# EAGLE design pcb master v2 (EAGLE 9.5.1)
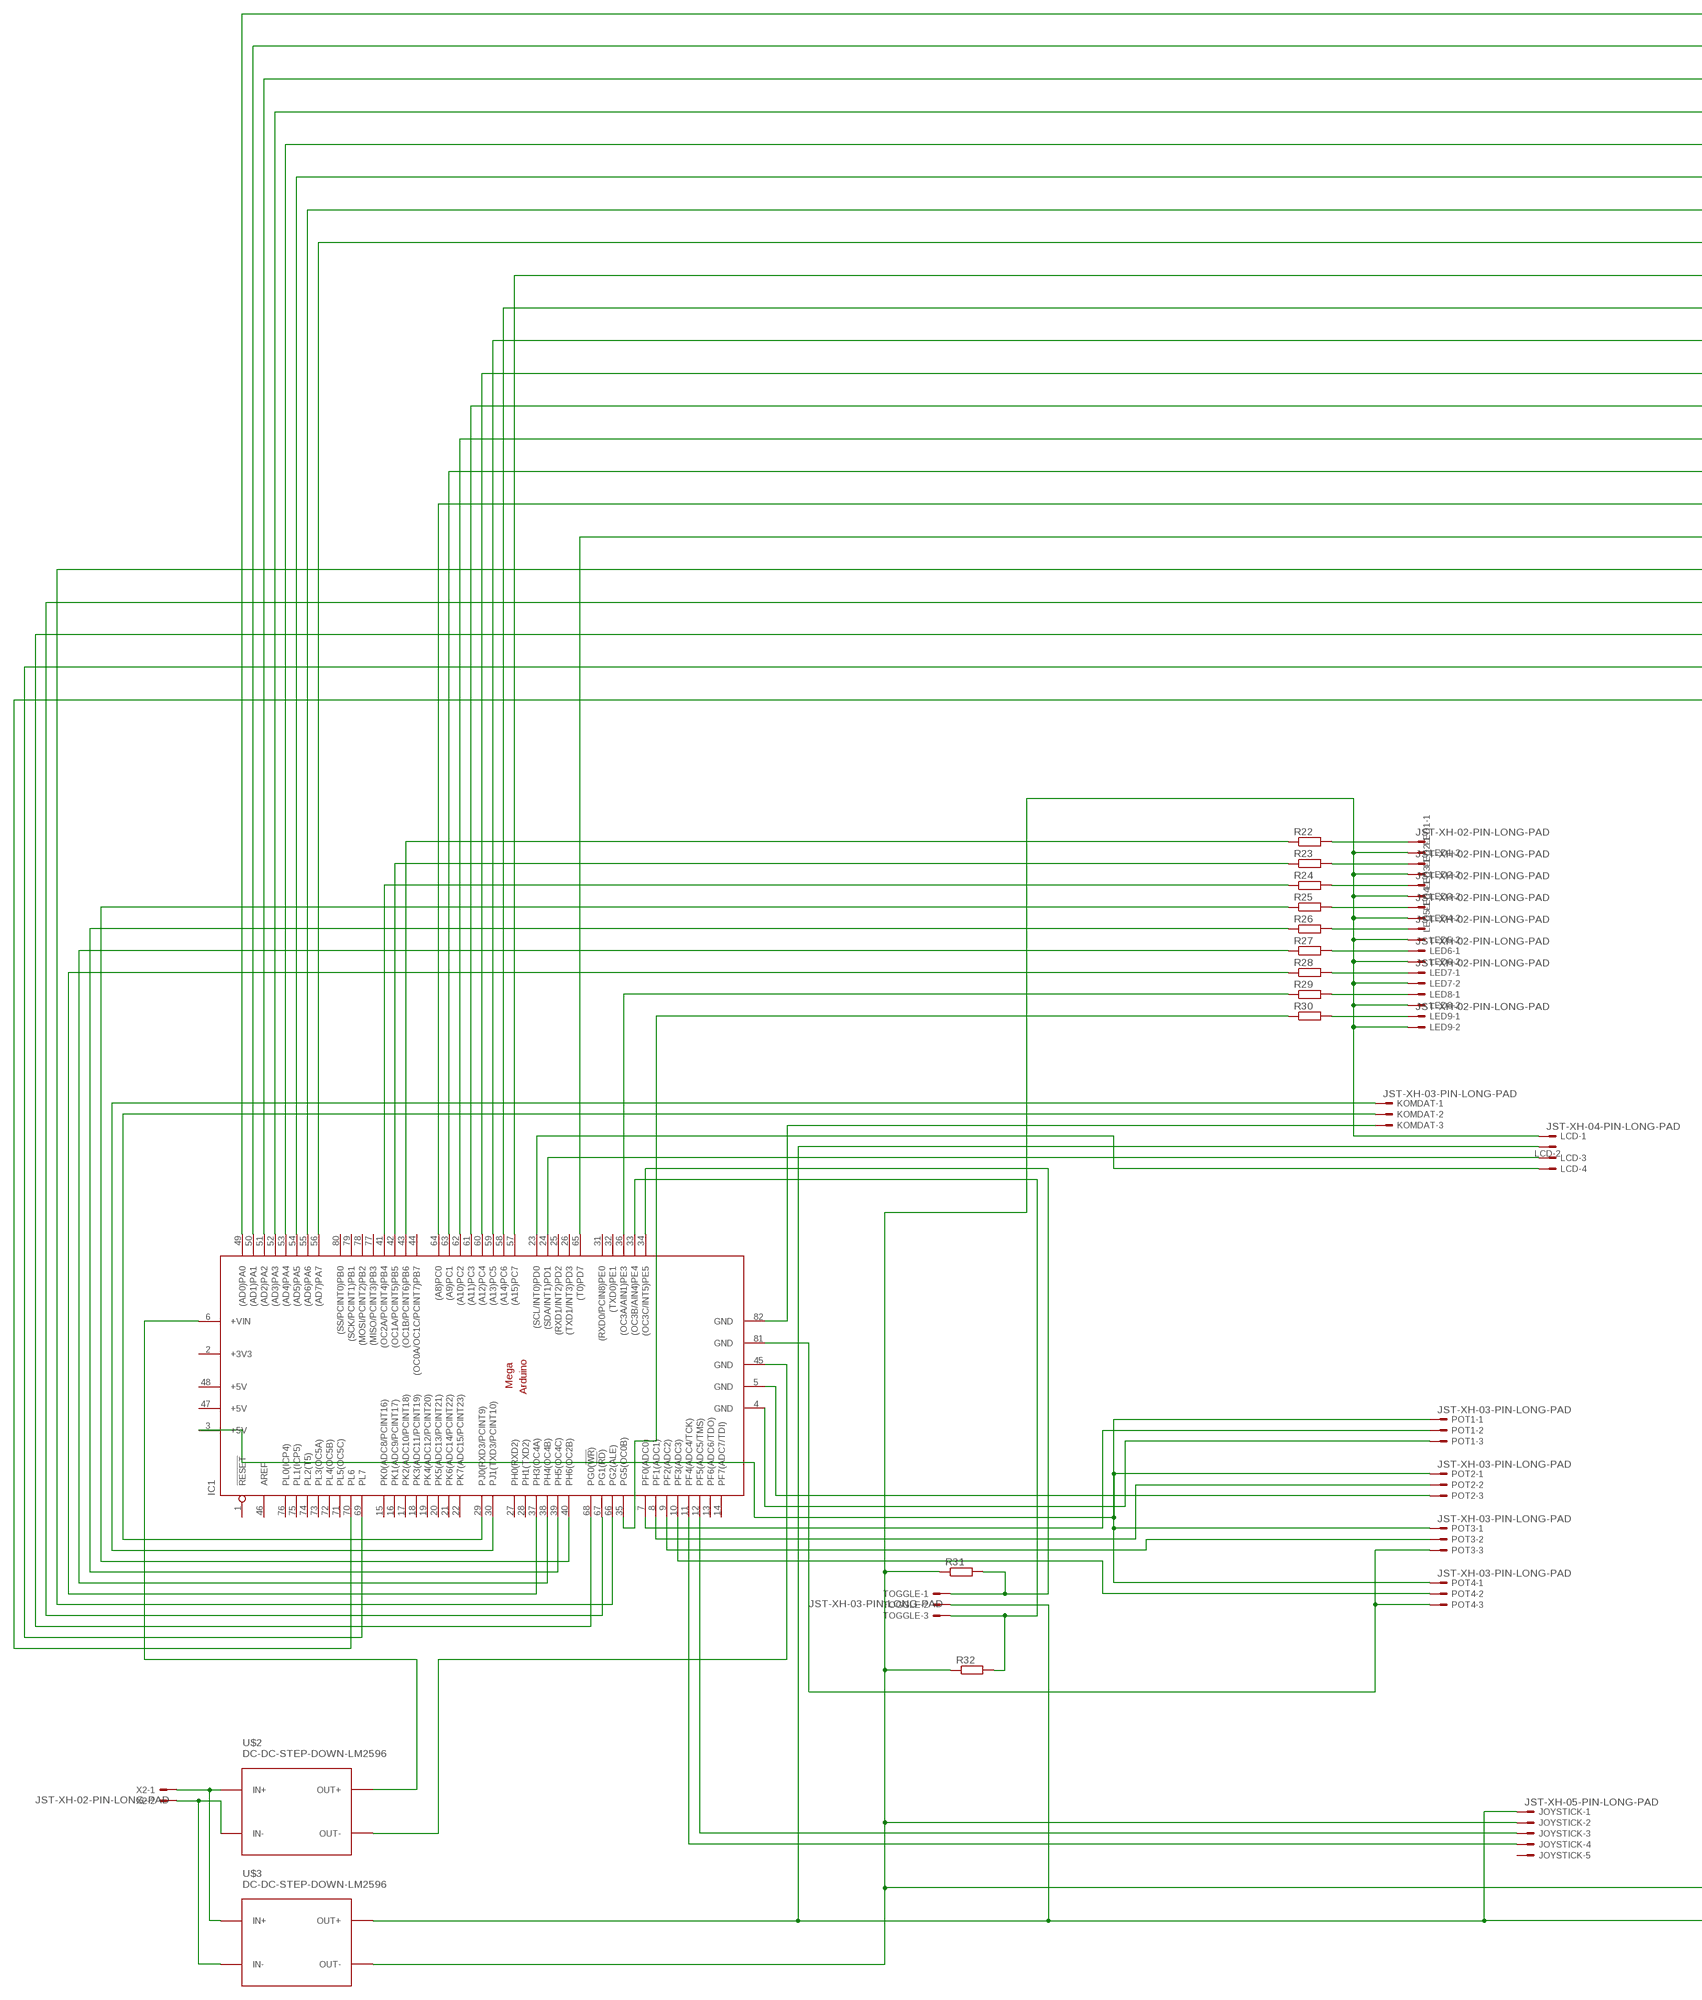
[diagram p0: schematic, sheet 1, part 1 of 2]
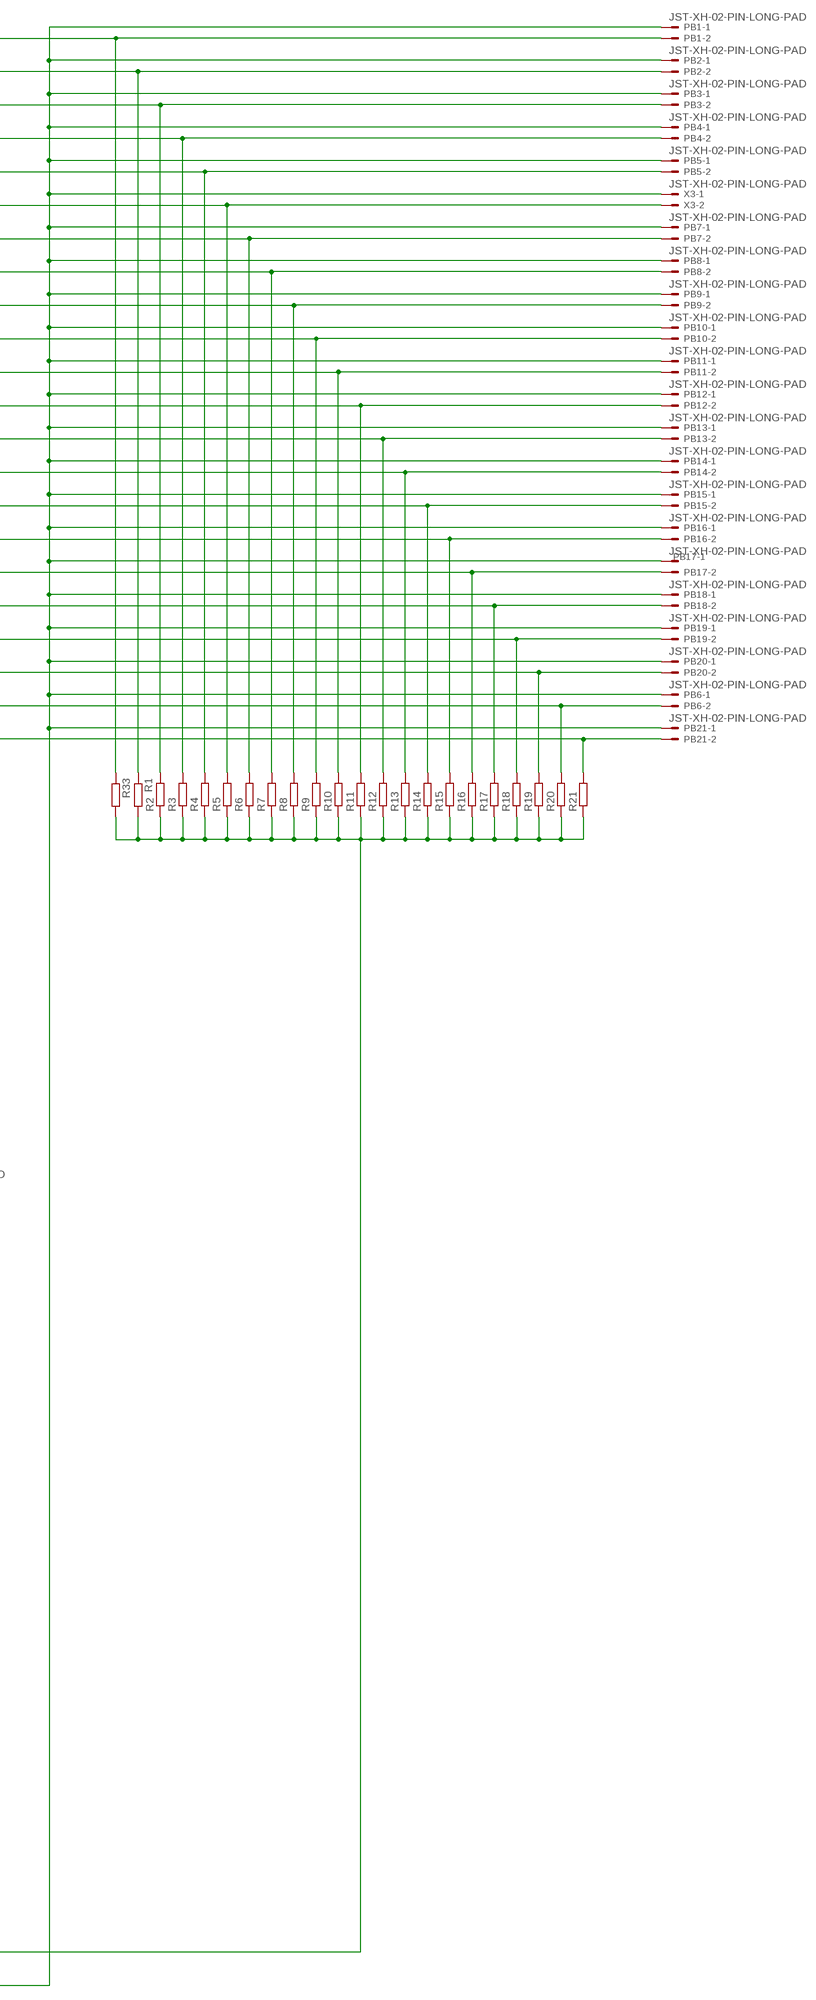
[diagram p1: schematic, sheet 1, part 2 of 2]

## Parts
IC1  MEGAARDUINO_1  [MEGA_ARDUINO]
JOYSTICK  JST-XH-05-PIN-LONG-PAD  [JST-XH-05-PACKAGE-LONG-PAD]
KOMDAT  JST-XH-03-PIN-LONG-PAD  [JST-XH-03-PACKAGE-LONG-PAD]
LCD  JST-XH-04-PIN-LONG-PAD  [JST-XH-04-PACKAGE-LONG-PAD]
LED1  JST-XH-02-PIN-LONG-PAD  [JST-XH-02-PACKAGE-LONG-PAD]
LED2  JST-XH-02-PIN-LONG-PAD  [JST-XH-02-PACKAGE-LONG-PAD]
LED3  JST-XH-02-PIN-LONG-PAD  [JST-XH-02-PACKAGE-LONG-PAD]
LED4  JST-XH-02-PIN-LONG-PAD  [JST-XH-02-PACKAGE-LONG-PAD]
LED5  JST-XH-02-PIN-LONG-PAD  [JST-XH-02-PACKAGE-LONG-PAD]
LED6  JST-XH-02-PIN-LONG-PAD  [JST-XH-02-PACKAGE-LONG-PAD]
LED7  JST-XH-02-PIN-LONG-PAD  [JST-XH-02-PACKAGE-LONG-PAD]
LED8  JST-XH-02-PIN-LONG-PAD  [JST-XH-02-PACKAGE-LONG-PAD]
LED9  JST-XH-02-PIN-LONG-PAD  [JST-XH-02-PACKAGE-LONG-PAD]
PB1  JST-XH-02-PIN-LONG-PAD  [JST-XH-02-PACKAGE-LONG-PAD]
PB2  JST-XH-02-PIN-LONG-PAD  [JST-XH-02-PACKAGE-LONG-PAD]
PB3  JST-XH-02-PIN-LONG-PAD  [JST-XH-02-PACKAGE-LONG-PAD]
PB4  JST-XH-02-PIN-LONG-PAD  [JST-XH-02-PACKAGE-LONG-PAD]
PB5  JST-XH-02-PIN-LONG-PAD  [JST-XH-02-PACKAGE-LONG-PAD]
PB6  JST-XH-02-PIN-LONG-PAD  [JST-XH-02-PACKAGE-LONG-PAD]
PB7  JST-XH-02-PIN-LONG-PAD  [JST-XH-02-PACKAGE-LONG-PAD]
PB8  JST-XH-02-PIN-LONG-PAD  [JST-XH-02-PACKAGE-LONG-PAD]
PB9  JST-XH-02-PIN-LONG-PAD  [JST-XH-02-PACKAGE-LONG-PAD]
PB10  JST-XH-02-PIN-LONG-PAD  [JST-XH-02-PACKAGE-LONG-PAD]
PB11  JST-XH-02-PIN-LONG-PAD  [JST-XH-02-PACKAGE-LONG-PAD]
PB12  JST-XH-02-PIN-LONG-PAD  [JST-XH-02-PACKAGE-LONG-PAD]
PB13  JST-XH-02-PIN-LONG-PAD  [JST-XH-02-PACKAGE-LONG-PAD]
PB14  JST-XH-02-PIN-LONG-PAD  [JST-XH-02-PACKAGE-LONG-PAD]
PB15  JST-XH-02-PIN-LONG-PAD  [JST-XH-02-PACKAGE-LONG-PAD]
PB16  JST-XH-02-PIN-LONG-PAD  [JST-XH-02-PACKAGE-LONG-PAD]
PB17  JST-XH-02-PIN-LONG-PAD  [JST-XH-02-PACKAGE-LONG-PAD]
PB18  JST-XH-02-PIN-LONG-PAD  [JST-XH-02-PACKAGE-LONG-PAD]
PB19  JST-XH-02-PIN-LONG-PAD  [JST-XH-02-PACKAGE-LONG-PAD]
PB20  JST-XH-02-PIN-LONG-PAD  [JST-XH-02-PACKAGE-LONG-PAD]
PB21  JST-XH-02-PIN-LONG-PAD  [JST-XH-02-PACKAGE-LONG-PAD]
POT1  JST-XH-03-PIN-LONG-PAD  [JST-XH-03-PACKAGE-LONG-PAD]
POT2  JST-XH-03-PIN-LONG-PAD  [JST-XH-03-PACKAGE-LONG-PAD]
POT3  JST-XH-03-PIN-LONG-PAD  [JST-XH-03-PACKAGE-LONG-PAD]
POT4  JST-XH-03-PIN-LONG-PAD  [JST-XH-03-PACKAGE-LONG-PAD]
R1  R-EU_0207/12  [0207/12]
R2  R-EU_0207/12  [0207/12]
R3  R-EU_0207/12  [0207/12]
R4  R-EU_0207/12  [0207/12]
R5  R-EU_0207/12  [0207/12]
R6  R-EU_0207/12  [0207/12]
R7  R-EU_0207/12  [0207/12]
R8  R-EU_0207/12  [0207/12]
R9  R-EU_0207/12  [0207/12]
R10  R-EU_0207/12  [0207/12]
R11  R-EU_0207/12  [0207/12]
R12  R-EU_0207/12  [0207/12]
R13  R-EU_0207/12  [0207/12]
R14  R-EU_0207/12  [0207/12]
R15  R-EU_0207/12  [0207/12]
R16  R-EU_0207/12  [0207/12]
R17  R-EU_0207/12  [0207/12]
R18  R-EU_0207/12  [0207/12]
R19  R-EU_0207/12  [0207/12]
R20  R-EU_0207/12  [0207/12]
R21  R-EU_0207/12  [0207/12]
R22  R-EU_0207/12  [0207/12]
R23  R-EU_0207/12  [0207/12]
R24  R-EU_0207/12  [0207/12]
R25  R-EU_0207/12  [0207/12]
R26  R-EU_0207/12  [0207/12]
R27  R-EU_0207/12  [0207/12]
R28  R-EU_0207/12  [0207/12]
R29  R-EU_0207/12  [0207/12]
R30  R-EU_0207/12  [0207/12]
R31  R-EU_0207/12  [0207/12]
R32  R-EU_0207/12  [0207/12]
R33  R-EU_0207/12  [0207/12]
TOGGLE  JST-XH-03-PIN-LONG-PAD  [JST-XH-03-PACKAGE-LONG-PAD]
U$2  DC-DC-STEP-DOWN-LM2596  [DC-DC-STEP-DOWN-LM2596]
U$3  DC-DC-STEP-DOWN-LM2596  [DC-DC-STEP-DOWN-LM2596]
X2  JST-XH-02-PIN-LONG-PAD  [JST-XH-02-PACKAGE-LONG-PAD]
X3  JST-XH-02-PIN-LONG-PAD  [JST-XH-02-PACKAGE-LONG-PAD]

## Nets
N$1: IC1.33((OC3B/AIN4)PE4) R32.2 TOGGLE.3
N$3: U$2.IN+ U$3.IN+ X2.1
N$4: U$2.IN- U$3.IN- X2.2
N$5: IC1.60((A12)PC4) PB12.2 R11.2
N$7: IC1.7(PF0(ADC0)) POT1.2
N$8: LED1.1 R22.2
N$9: LED2.1 R23.2
N$10: IC1.10(PF3(ADC3)) POT4.2
N$11: IC1.34((OC3C/INT5)PE5) R31.2 TOGGLE.1
N$12: LED3.1 R24.2
N$13: IC1.57((A15)PC7) PB9.2 R8.2
N$14: IC1.8(PF1(ADC1)) POT2.2
N$15: IC1.9(PF2(ADC2)) POT3.2
N$16: IC1.82(GND) KOMDAT.3
N$18: IC1.11(PF4(ADC4/TCK)) JOYSTICK.4
N$19: IC1.81(GND) POT3.3 POT4.3
N$21: LED4.1 R25.2
N$22: IC1.24((SDA/INT1)PD1) LCD.3
N$23: IC1.23((SCL/INT0)PD0) LCD.4
N$24: IC1.29(PJ0(RXD3/PCINT9)) KOMDAT.2
N$26: IC1.70(PL6) PB21.2 R21.2
N$27: IC1.59((A13)PC5) PB11.2 R10.2
N$28: IC1.69(PL7) PB6.2 R20.2
N$29: IC1.45(GND) U$2.OUT-
N$30: JOYSTICK.2 LCD.1 LED1.2 LED2.2 LED3.2 LED4.2 LED5.2 LED6.2 LED7.2 LED8.2 LED9.2 R1.2 R2.1 R3.1 R4.1 R5.1 R6.1 R7.1 R8.1 R9.1 R10.1 R11.1 R12.1 R13.1 R14.1 R15.1 R16.1 R17.1 R18.1 R19.1 R20.1 R21.1 R31.1 R32.1 R33.2 U$3.OUT-
N$31: LED7.1 R28.2
N$32: IC1.6(+VIN) U$2.OUT+
N$33: IC1.65((T0)PD7) PB17.2 R16.2
N$34: IC1.3(+5V) POT1.1 POT2.1 POT3.1 POT4.1
N$36: IC1.64((A8)PC0) PB16.2 R15.2
N$37: IC1.30(PJ1(TXD3/PCINT10)) KOMDAT.1
N$39: IC1.66(PG2(ALE)) PB18.2 R17.2
N$40: IC1.12(PF5(ADC5/TMS)) JOYSTICK.3
N$42: IC1.54((AD5)PA5) R5.2 X3.2
N$43: IC1.58((A14)PC6) PB10.2 R9.2
N$44: IC1.49((AD0)PA0) PB1.2 R33.1
N$45: IC1.68(PG0(!WR!)) PB20.2 R19.2
N$46: IC1.50((AD1)PA1) PB2.2 R1.1
N$47: IC1.52((AD3)PA3) PB4.2 R3.2
N$48: LED5.1 R26.2
N$49: LED6.1 R27.2
N$52: LED8.1 R29.2
N$53: LED9.1 R30.2
N$58: IC1.35(PG5(OC0B)) R30.1
N$59: IC1.36((OC3A/AIN1)PE3) R29.1
N$60: IC1.37(PH3(OC4A)) R28.1
N$61: IC1.38(PH4(OC4B)) R27.1
N$62: IC1.39(PH5(OC4C)) R26.1
N$63: IC1.40(PH6(OC2B)) R25.1
N$64: IC1.41((OC2A/PCINT4)PB4) R24.1
N$65: IC1.42((OC1A/PCINT5)PB5) R23.1
N$66: IC1.43((OC1B/PCINT6)PB6) R22.1
N$67: IC1.62((A10)PC2) PB14.2 R13.2
N$68: IC1.56((AD7)PA7) PB8.2 R7.2
N$70: IC1.4(GND) POT1.3
N$71: IC1.5(GND) POT2.3
N$75: IC1.61((A11)PC3) PB13.2 R12.2
N$76: IC1.63((A9)PC1) PB15.2 R14.2
N$81: IC1.67(PG1(!RD!)) PB19.2 R18.2
N$83: JOYSTICK.1 LCD.2 PB1.1 PB2.1 PB3.1 PB4.1 PB5.1 PB6.1 PB7.1 PB8.1 PB9.1 PB10.1 PB11.1 PB12.1 PB13.1 PB14.1 PB15.1 PB16.1 PB17.1 PB18.1 PB19.1 PB20.1 PB21.1 TOGGLE.2 U$3.OUT+ X3.1
N$91: IC1.51((AD2)PA2) PB3.2 R2.2
N$92: IC1.53((AD4)PA4) PB5.2 R4.2
N$93: IC1.55((AD6)PA6) PB7.2 R6.2
Unconnected: IC1.1(!RESET) IC1.13(PF6(ADC6/TDO)) IC1.14(PF7(ADC7/TDI)) IC1.15(PK0(ADC8/PCINT16)) IC1.16(PK1(ADC9/PCINT17)) IC1.17(PK2(ADC10/PCINT18)) IC1.18(PK3(ADC11/PCINT19)) IC1.19(PK4(ADC12/PCINT20)) IC1.20(PK5(ADC13/PCINT21)) IC1.21(PK6(ADC14/PCINT22)) IC1.22(PK7(ADC15/PCINT23)) IC1.25((RXD1/INT2)PD2) IC1.26((TXD1/INT3)PD3) IC1.27(PH0(RXD2)) IC1.28(PH1(TXD2)) IC1.31((RXD0/PCIN8)PE0) IC1.32((TXD0)PE1) IC1.44((OC0A/OC1C/PCINT7)PB7) IC1.46(AREF) IC1.71(PL5(OC5C)) IC1.72(PL4(OC5B)) IC1.73(PL3(OC5A)) IC1.74(PL2(T5)) IC1.75(PL1(ICP5)) IC1.76(PL0(ICP4)) IC1.77((MISO/PCINT3)PB3) IC1.78((MOSI/PCINT2)PB2) IC1.79((SCK/PCINT1)PB1) IC1.80((SS/PCINT0)PB0) JOYSTICK.5

## Power pins joined to a net without a drawn wire
+3V3: IC1.2(+3V3)
+5V: IC1.47(+5V) IC1.48(+5V)

## Library data of the parts
IC1 = arduino:MEGAARDUINO_1: The Arduino Mega is a microcontroller board based on the ATmega1280. - 54 digital input/output pins (of which 14 can be used as PWM outputs) - 16 analog inputs - 4 UARTs (hardware serial ports) - 16 MHz crystal oscillator - USB connection - power jack - ICSP header - reset button It contains everything needed to support the microcontroller; simply connect it to a computer with a USB cable or power it with a AC-to-DC adapter or battery to get started. The Mega is compatible with most shields designed for the Arduino Duemilanove or Diecimila. http://arduino.cc/en/Main/ArduinoBoardMega
JOYSTICK = Rembrandt Electronics - JST XH Connectors v1-0:JST-XH-05-PIN: JST XH Connector 2 Pin Wire to board connector. Pitch: 2,54 mm, (0.100") Number of pins: 5 Created by Rembrandt Electronics www.rembrandtelectronics.com
KOMDAT POT1-POT4 TOGGLE = Rembrandt Electronics - JST XH Connectors v1-0:JST-XH-03-PIN: JST XH Connector 2 Pin Wire to board connector. Pitch: 2,54 mm, (0.100") Number of pins: 3 Created by Rembrandt Electronics www.rembrandtelectronics.com
LCD = Rembrandt Electronics - JST XH Connectors v1-0:JST-XH-04-PIN: JST XH Connector 2 Pin Wire to board connector. Pitch: 2,54 mm, (0.100") Number of pins: 4 Created by Rembrandt Electronics www.rembrandtelectronics.com
LED1-LED9 PB1-PB21 X2 X3 = Rembrandt Electronics - JST XH Connectors v1-0:JST-XH-02-PIN: JST XH Connector 2 Pin Wire to board connector. Pitch: 2,54 mm, (0.100") Number of pins: 2 Created by Rembrandt Electronics www.rembrandtelectronics.com
R1-R33 = rcl:R-EU_: RESISTOR, European symbol; SPICEPREFIX: R
U$2 U$3 = diy-modules:DC-DC-STEP-DOWN-LM2596: DC/DC Step-Down Regulator based on LM2596-ADJ chip

## Board
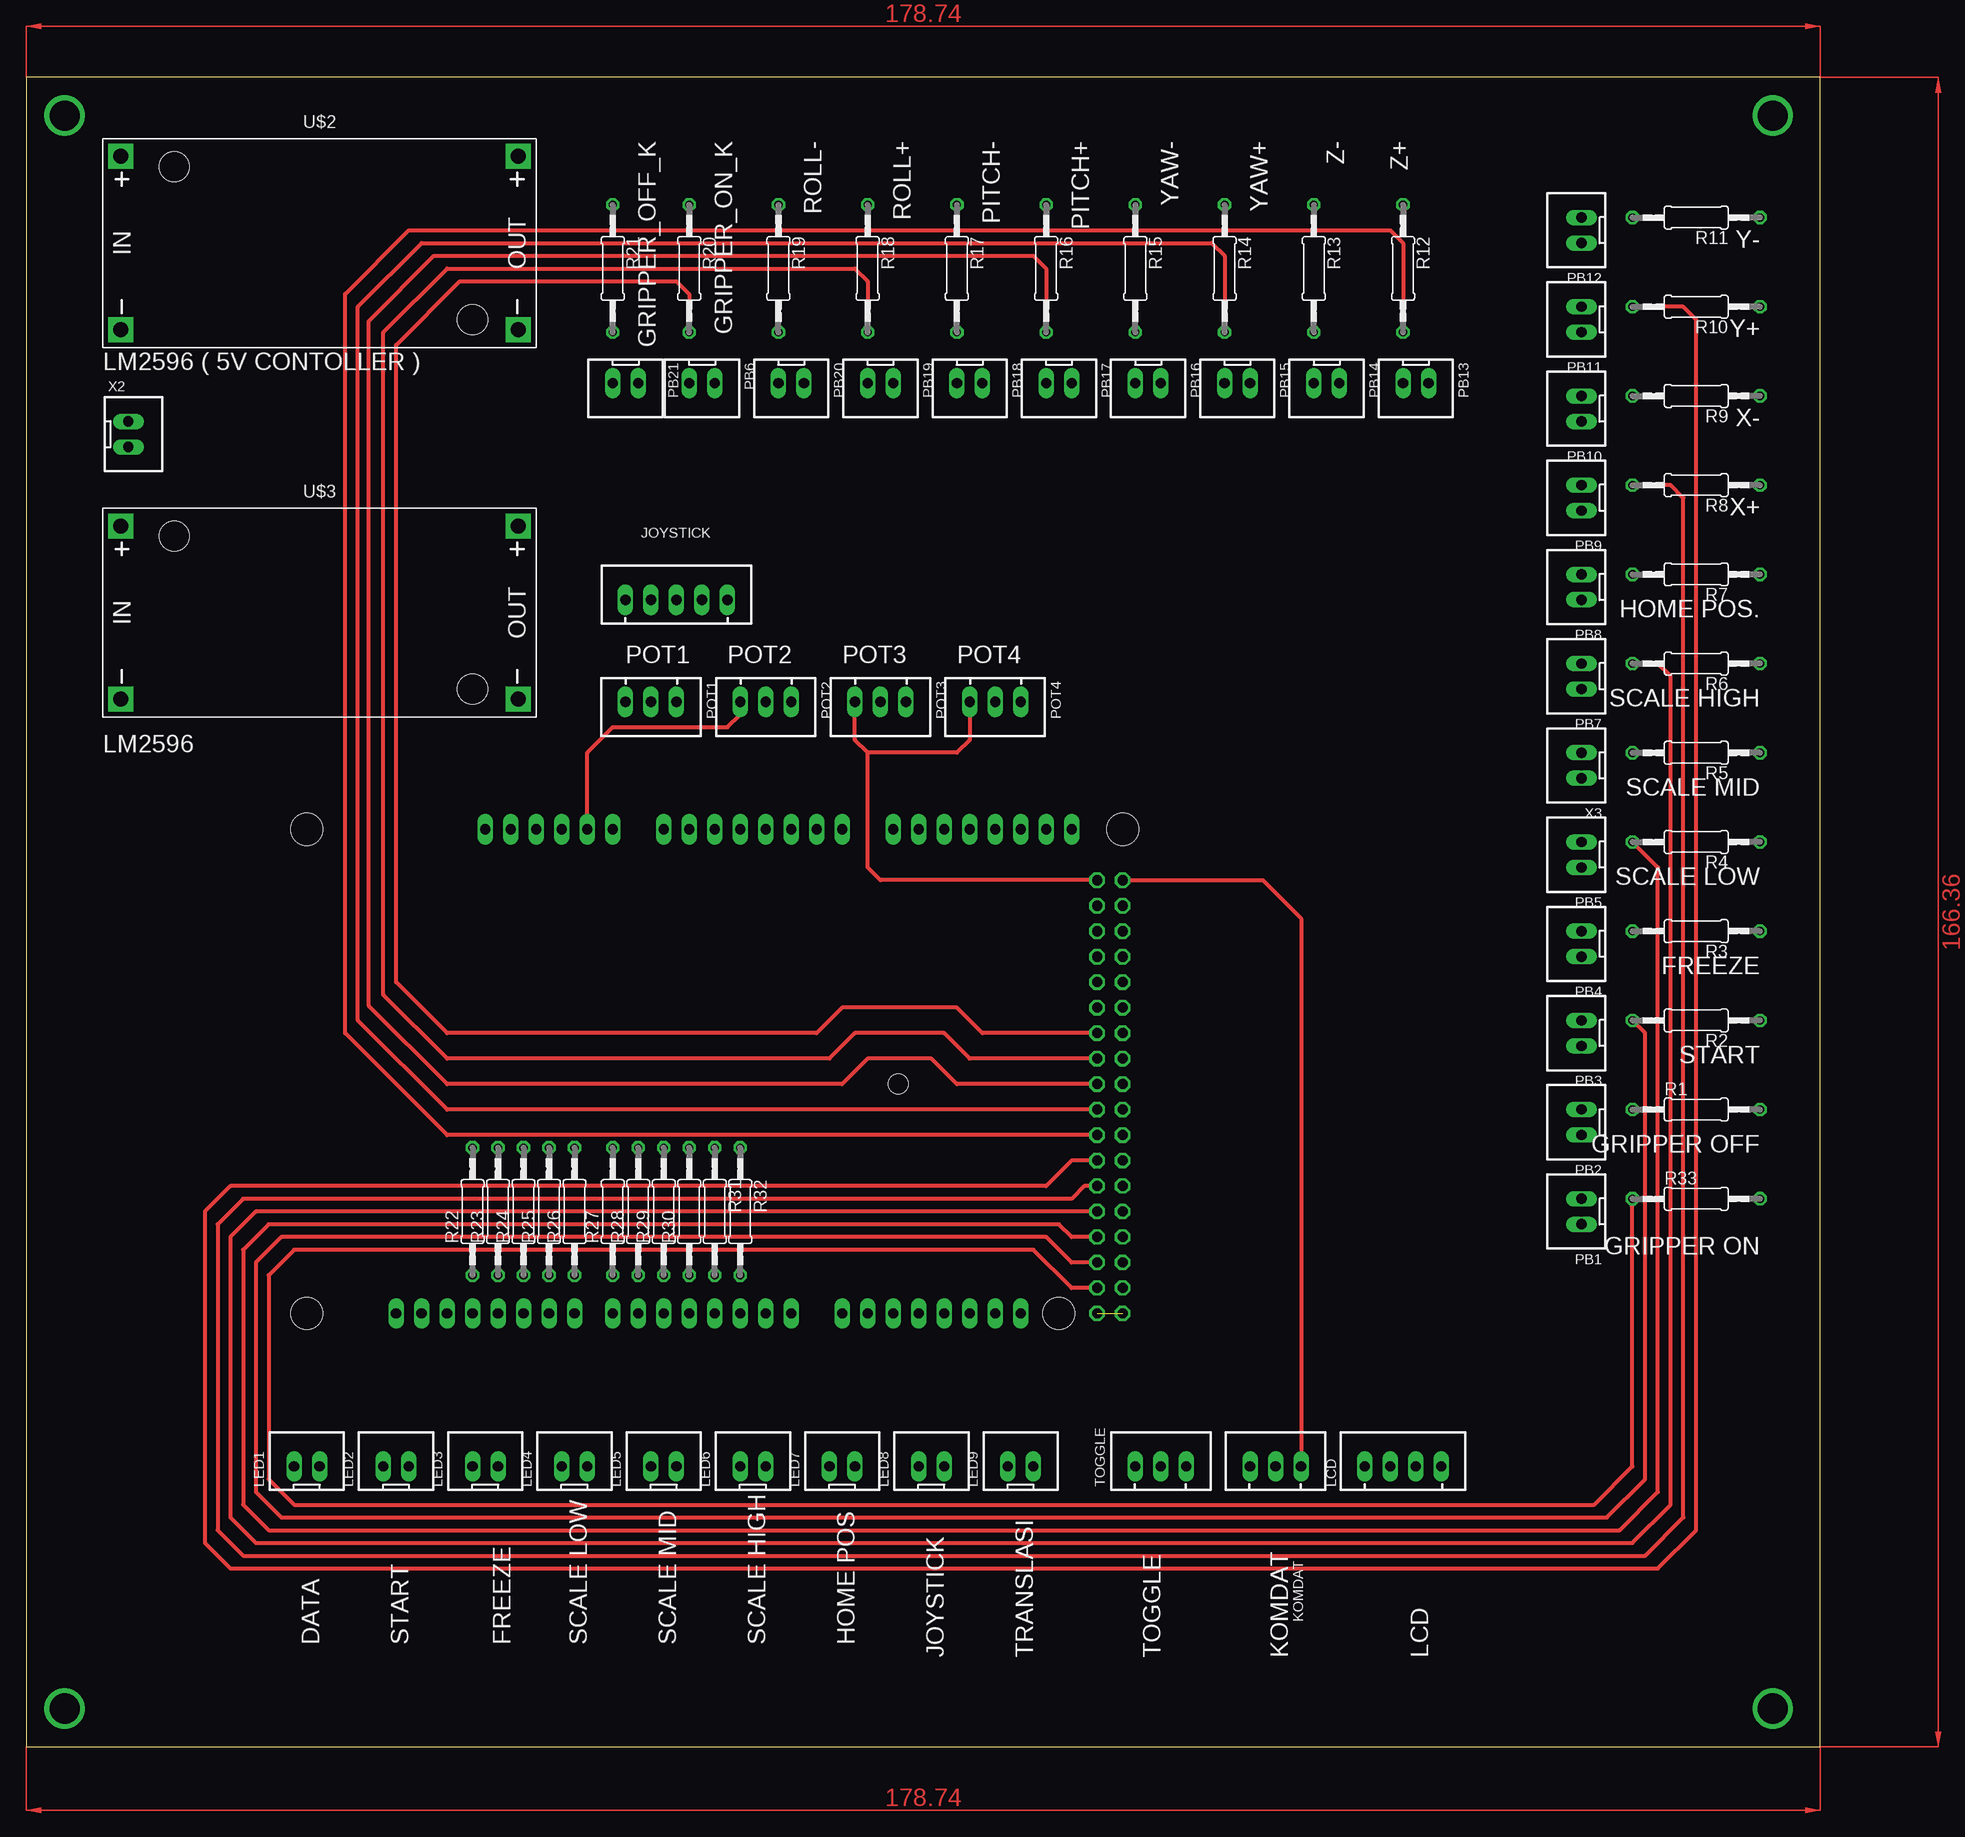
[diagram p2: board, top side]
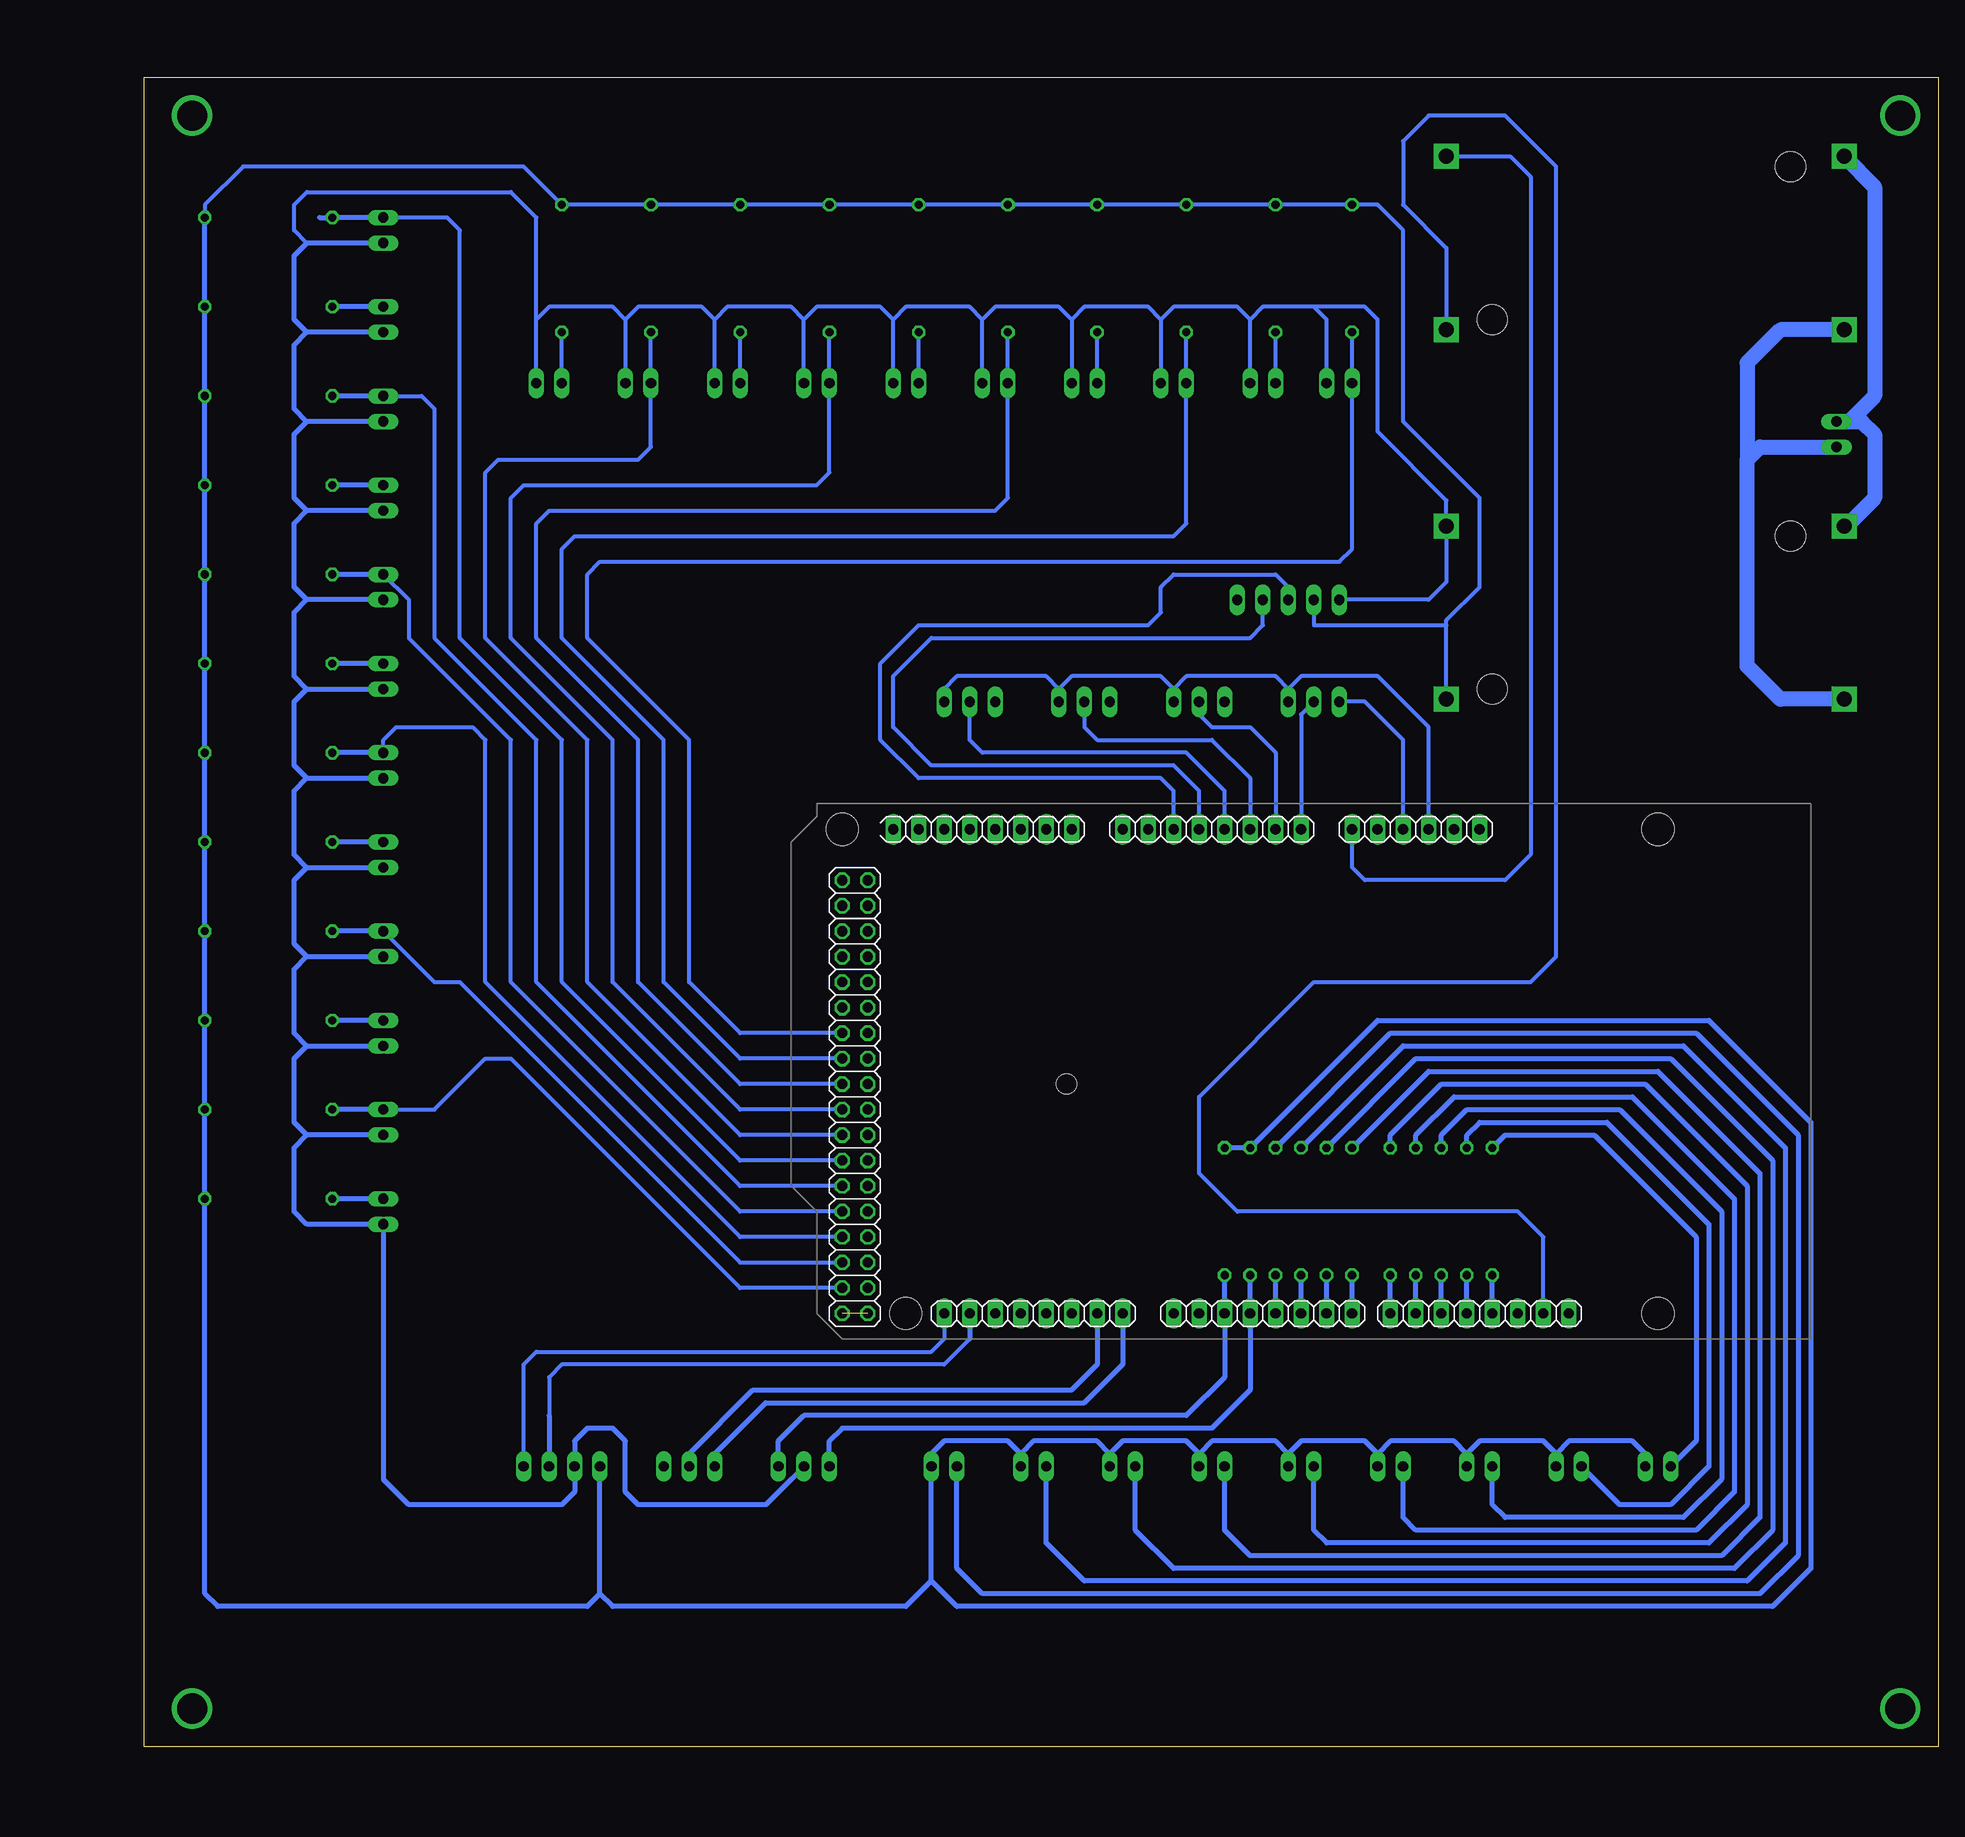
[diagram p3: board, bottom side, seen from below]

Size 178.74 x 166.36 mm. Coordinates in mm from the lower left corner, seen from the top.
Outline: 0,0 178.74,0 178.74,166.36 0,166.36 0,0
Copper layers (1*16): Top 0.035mm / dielectric 1.5mm / Bottom 0.035mm
Design rules "default *": minimum track width 6mil, minimum drill 0.35mm, track to track 10mil, track to pad 10mil, pad to pad 6mil, via to via 6mil, smd to smd 6mil, copper to edge 40mil, drill to drill 6mil, minimum pad ring 10mil, minimum via ring 8mil, stop-mask expansion 4mil, vias tented up to drill 0mil, thermal gap 10mil

### Footprints (pad centres in the part's own frame; a part is rotated, then mirrored left to right if it is on the bottom)
MEGA_ARDUINO = drill 1.016 long: 1 33.02,2.54; 2 35.56,2.54; 3 38.1,2.54; 4 40.64,2.54; 5 43.18,2.54; 6 45.72,2.54; 7 50.8,2.54; 8 53.34,2.54; 9 55.88,2.54; 10 58.42,2.54; 11 60.96,2.54; 12 63.5,2.54; 13 66.04,2.54; 14 68.58,2.54; 15 73.66,2.54; 16 76.2,2.54; 17 78.74,2.54; 18 81.28,2.54; 19 83.82,2.54; 20 86.36,2.54; 21 88.9,2.54; 22 91.44,2.54; 23 86.36,50.8; 24 83.82,50.8; 25 81.28,50.8; 26 78.74,50.8; 27 76.2,50.8; 28 73.66,50.8; 29 71.12,50.8; 30 68.58,50.8; 31 63.5,50.8; 32 60.96,50.8; 33 58.42,50.8; 34 55.88,50.8; 35 53.34,50.8; 36 50.8,50.8; 37 48.26,50.8; 38 45.72,50.8; 39 41.91,50.8; 40 39.37,50.8; 41 36.83,50.8; 42 34.29,50.8; 43 31.75,50.8; 44 29.21,50.8; 45 26.67,50.8; 46 24.13,50.8 | drill 1.016 octagon: 47 93.98,50.8; 48 96.52,50.8; 49 93.98,48.26; 50 96.52,48.26; 51 93.98,45.72; 52 96.52,45.72; 53 93.98,43.18; 54 96.52,43.18; 55 93.98,40.64; 56 96.52,40.64; 57 93.98,38.1; 58 96.52,38.1; 59 93.98,35.56; 60 96.52,35.56; 61 93.98,33.02; 62 96.52,33.02; 63 93.98,30.48; 64 96.52,30.48; 65 93.98,27.94; 66 96.52,27.94; 67 93.98,25.4; 68 96.52,25.4; 69 93.98,22.86; 70 96.52,22.86; 71 93.98,20.32; 72 96.52,20.32; 73 93.98,17.78; 74 96.52,17.78; 75 93.98,15.24; 76 96.52,15.24; 77 93.98,12.7; 78 96.52,12.7; 79 93.98,10.16; 80 96.52,10.16; 81 93.98,7.62; 82 96.52,7.62 | hole 3.2: 15.24,50.8; 15.24,2.54; 90.17,50.8; 96.52,2.54 | hole 2: 74.168,27.94
JST-XH-05-PACKAGE-LONG-PAD = drill 1.016 long: 1 -5.08,0; 2 -2.54,0; 3 0,0; 4 2.54,0; 5 5.08,0
JST-XH-03-PACKAGE-LONG-PAD = drill 1.016 long: 1 -2.54,0; 2 0,0; 3 2.54,0
JST-XH-04-PACKAGE-LONG-PAD = drill 1.016 long: 1 -3.81,0; 2 -1.27,0; 3 1.27,0; 4 3.81,0
JST-XH-02-PACKAGE-LONG-PAD = drill 1.016 long: 1 -1.27,0; 2 1.27,0
0207/12 = drill 0.813 octagon: 1 -6.35,0; 2 6.35,0
DC-DC-STEP-DOWN-LM2596 = drill 1.5 pad 2.5 square: IN+ -19.812,8.636; IN- -19.812,-8.636; OUT+ 19.812,8.636; OUT- 19.812,-8.636 | hole 3: -14.478,7.62; 15.24,-7.62

### Placement (x,y rotation side)
IC1  12.7,93.98 180 bottom
JOYSTICK  64.77,114.3 0 top
KOMDAT  124.46,27.94 0 top
LCD  137.16,27.94 0 top
LED1  27.94,27.94 0 top
LED2  36.83,27.94 0 top
LED3  45.72,27.94 0 top
LED4  54.61,27.94 0 top
LED5  63.5,27.94 0 top
LED6  72.39,27.94 0 top
LED7  81.28,27.94 0 top
LED8  90.17,27.94 0 top
LED9  99.06,27.94 0 top
PB1  154.94,53.34 90 top
PB2  154.94,62.23 90 top
PB3  154.94,71.12 90 top
PB4  154.94,80.01 90 top
PB5  154.94,88.9 90 top
PB6  67.31,135.89 180 top
PB7  154.94,106.68 90 top
PB8  154.94,115.57 90 top
PB9  154.94,124.46 90 top
PB10  154.94,133.35 90 top
PB11  154.94,142.24 90 top
PB12  154.94,151.13 90 top
PB13  138.43,135.89 180 top
PB14  129.54,135.89 180 top
PB15  120.65,135.89 180 top
PB16  111.76,135.89 180 top
PB17  102.87,135.89 180 top
PB18  93.98,135.89 180 top
PB19  85.09,135.89 180 top
PB20  76.2,135.89 180 top
PB21  59.69,135.89 180 top
POT1  62.23,104.14 180 top
POT2  73.66,104.14 180 top
POT3  85.09,104.14 180 top
POT4  96.52,104.14 180 top
R1  166.37,63.5 0 top
R2  166.37,72.39 180 top
R3  166.37,81.28 180 top
R4  166.37,90.17 180 top
R5  166.37,99.06 180 top
R6  166.37,107.95 180 top
R7  166.37,116.84 180 top
R8  166.37,125.73 180 top
R9  166.37,134.62 180 top
R10  166.37,143.51 180 top
R11  166.37,152.4 180 top
R12  137.16,147.32 270 top
R13  128.27,147.32 270 top
R14  119.38,147.32 270 top
R15  110.49,147.32 270 top
R16  101.6,147.32 270 top
R17  92.71,147.32 270 top
R18  83.82,147.32 270 top
R19  74.93,147.32 270 top
R20  66.04,147.32 270 top
R21  58.42,147.32 270 top
R22  44.45,53.34 90 top
R23  46.99,53.34 90 top
R24  49.53,53.34 90 top
R25  52.07,53.34 90 top
R26  54.61,53.34 90 top
R27  58.42,53.34 90 top
R28  60.96,53.34 90 top
R29  63.5,53.34 90 top
R30  66.04,53.34 90 top
R31  68.58,53.34 270 top
R32  71.12,53.34 270 top
R33  166.37,54.61 0 top
TOGGLE  113.03,27.94 0 top
U$2  29.21,149.86 0 top
U$3  29.21,113.03 0 top
X2  10.16,130.81 270 top
X3  154.94,97.79 90 top

### Tracks (layer width: path | path; a pad name or v marks a point on that pad's centre or on a via)
+5V  (1 unrouted)
N$1
  Bottom 0.5: R32.2 IC1.33 71.12,36.83 74.93,33.02 113.03,33.02 115.57,30.48 TOGGLE.3
N$2  (via drill 3)
  other vias: 3.81,3.81
N$3
  Top 0.4: 9.14,121.67 U$3.IN+
  Bottom 1.5: U$2.IN+ 6.35,155.45 6.35,134.62 8.89,132.08 X2.1 7.62,132.08 6.35,130.81 6.35,124.46 9.14,121.67 U$3.IN+
N$4
  Bottom 1.5: U$2.IN- 15.75,141.22 19.05,137.92 19.05,128.27 | U$3.IN- 15.75,104.39 19.05,107.7 19.05,128.27 | 19.05,128.27 17.78,129.54 X2.2
N$5
  Bottom 0.4: IC1.60 119.38,58.42 137.16,76.2 137.16,100.33 147.32,110.49 147.32,151.13 148.59,152.4 PB12.2
  Bottom 0.5: PB12.2 R11.2 161.29,152.4
N$7
  Bottom 0.4: POT1.2 63.5,102.87 IC1.7
N$8
  Bottom 0.5: R22.2 43.18,60.96 34.29,60.96 24.13,50.8 24.13,30.48 LED1.1
N$9
  Bottom 0.5: R23.2 46.99,60.96 45.72,62.23 33.02,62.23 22.86,52.07 22.86,27.94 26.67,24.13 31.75,24.13 LED2.1
N$10
  Bottom 0.4: IC1.10 71.12,95.25 74.93,99.06 95.25,99.06 96.52,100.33 POT4.2
N$11
  Bottom 0.5: R31.2 IC1.34 68.58,35.56 72.39,31.75 109.22,31.75 110.49,30.48 TOGGLE.1
N$12
  Bottom 0.5: R24.2 49.53,60.96 46.99,63.5 31.75,63.5 21.59,53.34 21.59,26.67 25.4,22.86 43.18,22.86 44.45,24.13 LED3.1
N$13
  Top 0.4: IC1.57 105.41,55.88 104.14,54.61 21.59,54.61 19.05,52.07 19.05,21.59 21.59,19.05 161.29,19.05 165.1,22.86 165.1,124.46 163.83,125.73 R8.2
  Bottom 0.5: PB9.2 R8.2
N$14
  Bottom 0.4: POT2.2 73.66,102.87 72.39,101.6 68.58,101.6 66.04,99.06 IC1.8
N$15
  Bottom 0.4: POT3.2 85.09,101.6 83.82,100.33 72.39,100.33 68.58,96.52 IC1.9
N$16
  Top 0.4: IC1.82 123.19,86.36 127,82.55 KOMDAT.3
  Bottom 0.4: KOMDAT.3 127,29.21
N$17  (via drill 3)
  other vias: 173.99,3.81
N$18
  Bottom 0.4: IC1.11 73.66,95.25 76.2,97.79 100.33,97.79 104.14,101.6 104.14,106.68 100.33,110.49 68.58,110.49 67.31,111.76 JOYSTICK.4
N$19
  Top 0.4: IC1.81 85.09,86.36 83.82,87.63 83.82,99.06 | 83.82,99.06 82.55,100.33 POT3.3 | 83.82,99.06 92.71,99.06 93.98,100.33 POT4.3
N$20  (via drill 3)
  other vias: 3.81,162.56
N$21
  Bottom 0.5: R25.2 52.07,60.96 48.26,64.77 30.48,64.77 20.32,54.61 20.32,25.4 24.13,21.59 52.07,21.59 53.34,22.86 LED4.1
N$22
  Bottom 0.4: 96.52,40.64 99.06,38.1 137.16,38.1 138.43,36.83 138.43,33.02
  Bottom 0.5: IC1.24 96.52,40.64 | 138.43,33.02 LCD.3 138.43,26.67
N$23
  Bottom 0.4: LCD.4 140.97,38.1 139.7,39.37 100.33,39.37 99.06,40.64 IC1.23
N$24
  Bottom 0.5: IC1.29 83.82,38.1 86.36,35.56 118.11,35.56 124.46,29.21 KOMDAT.2
N$25  (via drill 3)
  other vias: 173.99,162.56
N$26
  Bottom 0.4: IC1.70 119.38,71.12 124.46,76.2 124.46,100.33 134.62,110.49 134.62,116.84 133.35,118.11 59.69,118.11 58.42,119.38 PB21.2 R21.2
N$27
  Top 0.4: IC1.59 104.14,58.42 101.6,55.88 20.32,55.88 17.78,53.34 17.78,20.32 20.32,17.78 162.56,17.78 166.37,21.59 166.37,142.24 165.1,143.51 R10.2
  Bottom 0.5: PB11.2 R10.2
N$28
  Top 0.4: IC1.69 95.25,71.12 92.71,73.66 81.28,73.66 78.74,71.12 41.91,71.12 36.83,76.2 36.83,139.7 43.18,146.05 64.77,146.05 66.04,144.78 R20.2
  Bottom 0.4: PB6.2 R20.2
N$29
  Bottom 0.4: IC1.45 39.37,50.8 41.91,53.34 69.85,53.34 73.66,57.15 73.66,64.77 62.23,76.2 40.64,76.2 38.1,78.74 38.1,157.48 43.18,162.56 50.8,162.56 53.34,160.02 53.34,153.67 49.02,149.35 U$2.OUT-
N$30
  Bottom 0.4: R11.1 172.72,153.67 168.91,157.48 140.97,157.48 R12.1 R13.1 R14.1 R15.1 R16.1 R17.1 R18.1 R19.1 R20.1 R21.1 55.88,153.67 53.34,151.13 53.34,132.08 45.72,124.46 45.72,115.57 49.02,112.27 U$3.OUT- 49.02,111.76 62.23,111.76 JOYSTICK.2
  Bottom 0.5: LED1.2 29.21,29.21 30.48,30.48 36.83,30.48 38.1,29.21 | 38.1,29.21 LED2.2 | 38.1,29.21 39.37,30.48 45.72,30.48 46.99,29.21 | 46.99,29.21 LED3.2 | 46.99,29.21 48.26,30.48 54.61,30.48 55.88,29.21 | 55.88,29.21 LED4.2 | 55.88,29.21 57.15,30.48 63.5,30.48 64.77,29.21 | LED5.2 64.77,29.21 | 64.77,29.21 66.04,30.48 72.39,30.48 73.66,29.21 | LED6.2 73.66,29.21 | 73.66,29.21 74.93,30.48 81.28,30.48 82.55,29.21 | LED7.2 82.55,29.21 | 82.55,29.21 83.82,30.48 90.17,30.48 91.44,29.21 | LED8.2 91.44,29.21 | 91.44,29.21 92.71,30.48 99.06,30.48 100.33,29.21 LED9.2 100.33,16.51 | R32.1 R31.1 55.88,72.39 22.86,72.39 12.7,62.23 12.7,17.78 16.51,13.97 97.79,13.97 100.33,16.51 | 100.33,16.51 102.87,13.97 132.08,13.97 133.35,15.24 | 133.35,15.24 LCD.1 | 133.35,15.24 134.62,13.97 171.45,13.97 172.72,15.24 R33.2 R1.2 R2.1 R3.1 R4.1 R5.1 R6.1 R7.1 R8.1 R9.1 R10.1 R11.1
N$31
  Bottom 0.5: R28.2 52.07,68.58 26.67,68.58 16.51,58.42 16.51,21.59 20.32,17.78 76.2,17.78 80.01,21.59 LED7.1
N$32
  Bottom 0.4: U$2.OUT+ 42.67,158.5 40.64,156.46 40.64,88.9 43.18,86.36 57.15,86.36 58.42,87.63 IC1.6
N$33
  Top 0.4: IC1.65 92.71,66.04 90.17,68.58 83.82,68.58 81.28,66.04 41.91,66.04 34.11,73.84 34.11,142.09 40.61,148.59 100.33,148.59 101.6,147.32 R16.2
  Bottom 0.4: PB17.2 R16.2
N$34
  Bottom 0.4: IC1.3 50.8,101.6 55.88,106.68 63.5,106.68 64.77,105.41 | 64.77,105.41 POT1.1 | 64.77,105.41 66.04,106.68 74.93,106.68 76.2,105.41 | 76.2,105.41 POT2.1 | 76.2,105.41 77.47,106.68 86.36,106.68 87.63,105.41 | POT3.1 87.63,105.41 | 87.63,105.41 88.9,106.68 97.79,106.68 99.06,105.41 POT4.1
N$36
  Bottom 0.4: IC1.64 119.38,63.5 132.08,76.2 132.08,100.33 142.24,110.49 142.24,124.46 140.97,125.73 111.76,125.73 110.49,127 PB16.2 R15.2
N$37
  Bottom 0.5: KOMDAT.1 121.92,29.21 116.84,34.29 85.09,34.29 81.28,38.1 IC1.30
N$39
  Bottom 0.4: IC1.66 119.38,66.04 129.54,76.2 129.54,100.33 139.7,110.49 139.7,121.92 138.43,123.19 93.98,123.19 92.71,124.46 PB18.2 R17.2
N$40
  Bottom 0.4: IC1.12 76.2,95.25 77.47,96.52 101.6,96.52 105.41,100.33 105.41,107.95 101.6,111.76 78.74,111.76 77.47,113.03 77.47,115.57 76.2,116.84 66.04,116.84 64.77,115.57 JOYSTICK.3
N$42
  Bottom 0.4: IC1.54 119.38,50.8 144.78,76.2 144.78,100.33 146.05,101.6 153.67,101.6 154.94,100.33 X3.2
  Bottom 0.5: X3.2 R5.2
N$43
  Bottom 0.4: IC1.58 119.38,55.88 139.7,76.2 139.7,100.33 149.86,110.49 149.86,133.35 151.13,134.62 PB10.2
  Bottom 0.5: PB10.2 R9.2
N$44
  Top 0.4: IC1.49 104.14,45.72 100.33,49.53 26.67,49.53 24.13,46.99 24.13,26.67 26.67,24.13 156.21,24.13 160.02,27.94 R33.1
  Bottom 0.4: IC1.49 106.68,45.27 | 153.67,54.61 PB1.2
  Bottom 0.5: PB1.2 R33.1
N$45
  Bottom 0.4: IC1.68 119.38,68.58 127,76.2 127,100.33 137.16,110.49 137.16,119.38 135.89,120.65 76.2,120.65 74.93,121.92 PB20.2 R19.2
N$46
  Bottom 0.4: IC1.50 119.38,45.72 142.24,68.58 144.78,68.58 149.86,63.5 PB2.2
  Bottom 0.5: PB2.2 R1.1
N$47
  Bottom 0.4: PB4.2 149.86,76.2 147.32,76.2 119.38,48.26 IC1.52
  Bottom 0.5: PB4.2 R3.2
N$48
  Bottom 0.5: R26.2 54.61,60.96 49.53,66.04 29.21,66.04 19.05,55.88 19.05,24.13 22.86,20.32 60.96,20.32 62.23,21.59 LED5.1
N$49
  Bottom 0.5: R27.2 50.8,67.31 27.94,67.31 17.78,57.15 17.78,22.86 21.59,19.05 68.58,19.05 71.12,21.59 LED6.1
N$52
  Bottom 0.5: R29.2 53.34,69.85 25.4,69.85 15.24,59.69 15.24,20.32 19.05,16.51 85.09,16.51 88.9,20.32 LED8.1
N$53
  Bottom 0.5: R30.2 54.61,71.12 24.13,71.12 13.97,60.96 13.97,19.05 17.78,15.24 95.25,15.24 97.79,17.78 LED9.1
N$58
  Bottom 0.5: IC1.35 R30.1
N$59
  Bottom 0.5: IC1.36 R29.1
N$60
  Bottom 0.5: IC1.37 R28.1
N$61
  Bottom 0.5: IC1.38 R27.1
N$62
  Bottom 0.5: IC1.39 R26.1
N$63
  Bottom 0.5: IC1.40 R25.1
N$64
  Bottom 0.5: IC1.41 R24.1
N$65
  Bottom 0.5: IC1.42 R23.1
N$66
  Bottom 0.5: IC1.43 R22.1
N$67
  Bottom 0.4: IC1.62 119.38,60.96 134.62,76.2 134.62,100.33 144.78,110.49 144.78,127 143.51,128.27 129.54,128.27 128.27,129.54 PB14.2 R13.2
N$68
  Bottom 0.4: IC1.56 119.38,53.34 142.24,76.2 142.24,100.33 152.4,110.49 152.4,114.3 PB8.2
  Bottom 0.5: PB8.2 R7.2
N$70
  Bottom 0.4: IC1.4 53.34,100.33 57.15,104.14 POT1.3
N$71
  Top 0.4: IC1.5 55.88,99.06 58.42,101.6 69.85,101.6 71.12,102.87 POT2.3
N$75
  Top 0.4: IC1.61 41.91,60.96 31.75,71.12 31.75,144.78 38.1,151.13 135.89,151.13 137.16,149.86 R12.2
  Bottom 0.4: PB13.2 R12.2
N$76
  Top 0.4: IC1.63 41.91,63.5 33.02,72.39 33.02,143.51 39.37,149.86 118.11,149.86 119.38,148.59 R14.2
  Bottom 0.4: PB15.2 R14.2
N$81
  Top 0.4: IC1.67 93.98,68.58 91.44,71.12 82.55,71.12 80.01,68.58 41.91,68.58 35.56,74.93 35.56,140.97 41.91,147.32 82.55,147.32 83.82,146.05 R18.2
  Bottom 0.4: PB19.2 R18.2
N$83
  Bottom 0.4: PB21.1 60.96,142.24 62.23,143.51 | 68.58,142.24 67.31,143.51 62.23,143.51 | PB6.1 68.58,142.24 | 68.58,142.24 69.85,143.51 76.2,143.51 77.47,142.24 | 77.47,142.24 PB20.1 | 77.47,142.24 78.74,143.51 85.09,143.51 86.36,142.24 | 86.36,142.24 PB19.1 | 86.36,142.24 87.63,143.51 93.98,143.51 95.25,142.24 | PB18.1 95.25,142.24 | 95.25,142.24 96.52,143.51 102.87,143.51 104.14,142.24 | PB17.1 104.14,142.24 | 104.14,142.24 105.41,143.51 111.76,143.51 113.03,142.24 | PB16.1 113.03,142.24 | 113.03,142.24 114.3,143.51 120.65,143.51 121.92,142.24 | PB15.1 121.92,142.24 | 121.92,142.24 123.19,143.51 129.54,143.51 130.81,142.24 | 130.81,142.24 PB14.1 | 130.81,142.24 132.08,143.51 138.43,143.51 139.7,142.24 | PB13.1 139.7,142.24 | 139.7,142.24 139.7,152.4 142.24,154.94 162.56,154.94 163.83,153.67 163.83,151.13 162.56,149.86 | 62.23,143.51 57.15,143.51 55.88,142.24 55.88,131.06 49.02,124.21 U$3.OUT+ 49.02,116.08 50.8,114.3 JOYSTICK.1
  Bottom 0.5: TOGGLE.2 114.3,26.67 114.3,26.65 116.83,24.13 129.54,24.13 130.81,25.4 130.81,30.48 132.08,31.75 134.62,31.75 135.89,30.48 LCD.2 135.89,25.4 137.16,24.13 152.4,24.13 154.94,26.67 PB1.1 162.56,52.07 163.83,53.34 163.83,59.69 162.56,60.96 | PB2.1 162.56,60.96 | 162.56,60.96 163.83,62.23 163.83,68.58 162.56,69.85 | 162.56,69.85 PB3.1 | 162.56,69.85 163.83,71.12 163.83,77.47 162.56,78.74 | 162.56,78.74 PB4.1 | 162.56,78.74 163.83,80.01 163.83,86.36 162.56,87.63 | 162.56,87.63 PB5.1 | 162.56,87.63 163.83,88.9 163.83,95.25 162.56,96.52 | 162.56,96.52 X3.1 | 162.56,96.52 163.83,97.79 163.83,104.14 162.56,105.41 | 162.56,105.41 PB7.1 | 162.56,105.41 163.83,106.68 163.83,113.03 162.56,114.3 | PB8.1 162.56,114.3 | 162.56,114.3 163.83,115.57 163.83,121.92 162.56,123.19 | PB9.1 162.56,123.19 | 162.56,123.19 163.83,124.46 163.83,130.81 162.56,132.08 | PB10.1 162.56,132.08 | 162.56,132.08 163.83,133.35 163.83,139.7 162.56,140.97 | PB11.1 162.56,140.97 | 162.56,140.97 163.83,142.24 163.83,148.59 162.56,149.86 PB12.1
N$91
  Top 0.4: IC1.51 104.14,48.26 101.6,50.8 25.4,50.8 22.86,48.26 22.86,25.4 25.4,22.86 157.48,22.86 161.29,26.67 161.29,71.12 R2.2
  Bottom 0.5: PB3.2 R2.2
N$92
  Top 0.4: IC1.53 104.14,50.8 102.87,52.07 24.13,52.07 21.59,49.53 21.59,24.13 24.13,21.59 158.75,21.59 162.56,25.4 162.56,87.63 R4.2
  Bottom 0.5: PB5.2 R4.2
N$93
  Top 0.4: R6.2 162.56,107.95 163.83,106.68 163.83,24.13 160.02,20.32 22.86,20.32 20.32,22.86 20.32,50.8 22.86,53.34 IC1.55
  Bottom 0.5: PB7.2 R6.2
(copper drawn outside any net)
  shapes: Top area x3

### Text on the board
tNames: GRIPPER_OFF_K | GRIPPER_ON_K | ROLL- | ROLL+ | PITCH- | PITCH+ | YAW- | YAW+ | Z- | Z+ | Y- | Y+ | LM2596 ( 5V CONTOLLER ) | X- | X+ | HOME POS. | POT1 | POT2 | POT3 | POT4 | SCALE HIGH | LM2596 | SCALE MID | SCALE LOW | FREEZE | START | GRIPPER OFF | GRIPPER ON | DATA | START | FREEZE | SCALE LOW | SCALE MID | SCALE HIGH | HOME POS | JOYSTICK | TRANSLASI | TOGGLE | KOMDAT | LCD